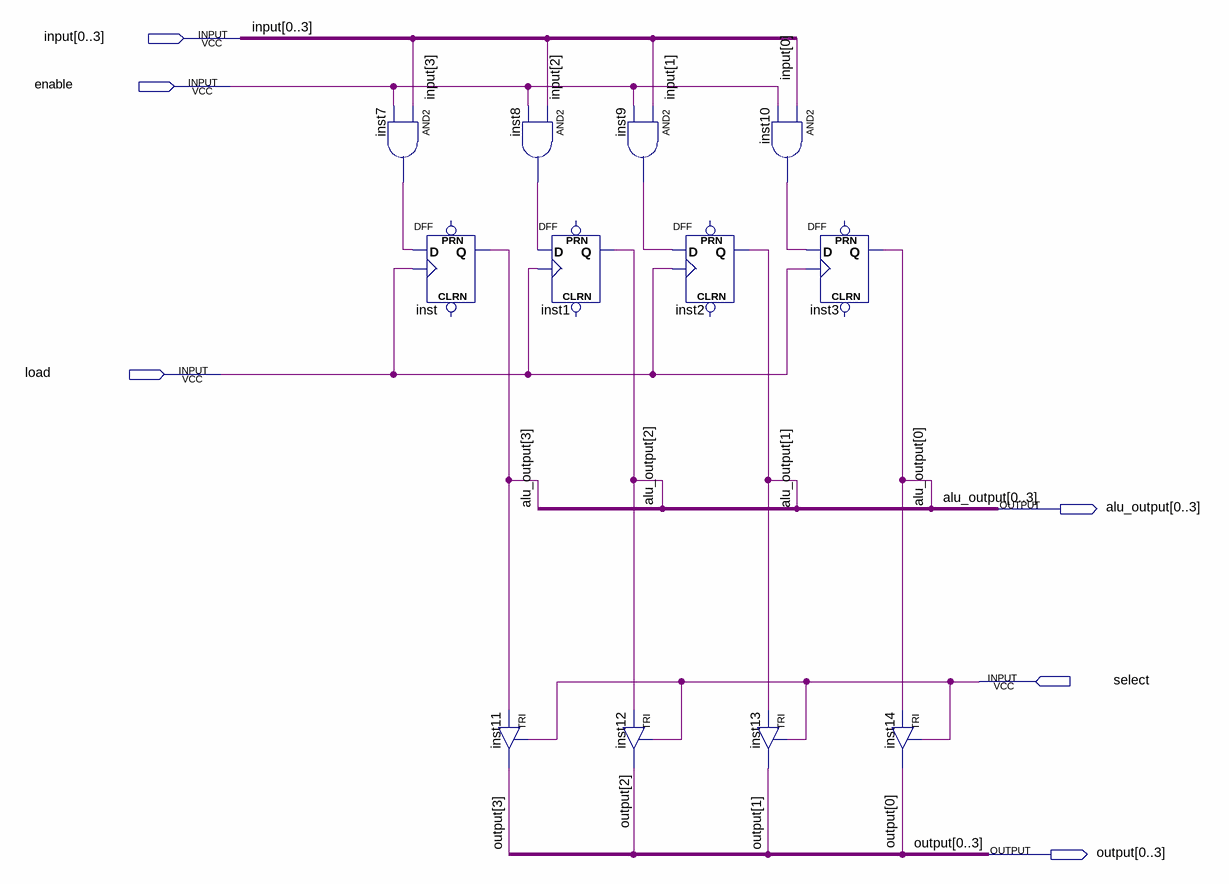
[diagram p0: schematic sheet]
// Quartus schematic 4bit_register.bdf as structural Verilog: 12 symbols, 6 pins
module \4bit_register  (
  input  [0:3] \input ,
  input  enable,
  input  load,
  input  select,
  output [0:3] alu_output,
  output [0:3] \output 
);

  wire inst7_out, inst8_out, inst9_out, inst10_out;

  and inst7 (inst7_out, \input [3], enable);
  DFF inst (.CLK(load), .D(inst7_out), .Q(alu_output[3]));  // open: CLRN, PRN
  and inst8 (inst8_out, \input [2], enable);
  DFF inst1 (.CLK(load), .D(inst8_out), .Q(alu_output[2]));  // open: CLRN, PRN
  TRI inst11 (.IN(alu_output[3]), .OE(select), .OUT(\output [3]));
  and inst9 (inst9_out, \input [1], enable);
  TRI inst12 (.IN(alu_output[2]), .OE(select), .OUT(\output [2]));
  DFF inst2 (.CLK(load), .D(inst9_out), .Q(alu_output[1]));  // open: CLRN, PRN
  and inst10 (inst10_out, \input [0], enable);
  TRI inst13 (.IN(alu_output[1]), .OE(select), .OUT(\output [1]));
  DFF inst3 (.CLK(load), .D(inst10_out), .Q(alu_output[0]));  // open: CLRN, PRN
  TRI inst14 (.IN(alu_output[0]), .OE(select), .OUT(\output [0]));
endmodule
